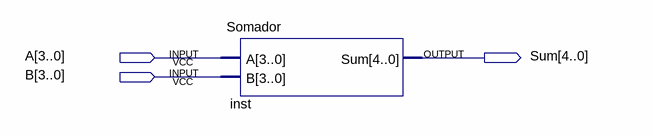
[diagram p0: schematic sheet]
// Quartus schematic testSomador.bdf as structural Verilog: 1 symbols, 3 pins
module testSomador (
  input  [3:0] A,
  input  [3:0] B,
  output [4:0] Sum
);

  Somador inst (.A(A), .B(B), .Sum(Sum));
endmodule
